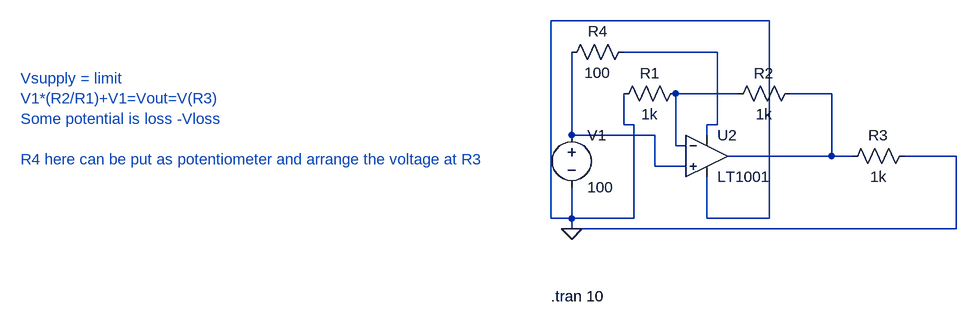
[diagram p0: schematic single supply opamp for voltage regulation.asc]
single supply opamp for voltage regulation.asc, the LTspice schematic file:
Version 4
SHEET 1 880 680
WIRE 320 -48 -16 -48
WIRE 240 0 96 0
WIRE 272 64 176 64
WIRE 416 64 352 64
WIRE 96 112 96 64
WIRE 112 112 96 112
WIRE 240 112 240 0
WIRE 240 112 224 112
WIRE 16 128 16 0
WIRE 144 128 16 128
WIRE 224 128 224 112
WIRE 176 144 176 64
WIRE 192 144 176 144
WIRE 416 160 416 64
WIRE 416 160 256 160
WIRE 448 160 416 160
WIRE 608 160 528 160
WIRE 144 176 144 128
WIRE 192 176 144 176
WIRE -16 256 -16 -48
WIRE 16 256 16 208
WIRE 16 256 -16 256
WIRE 112 256 112 112
WIRE 112 256 16 256
WIRE 224 256 224 192
WIRE 320 256 320 -48
WIRE 320 256 224 256
WIRE 16 272 16 256
WIRE 608 272 608 160
WIRE 608 272 16 272
FLAG 16 272 0
SYMBOL voltage 16 112 R0
WINDOW 123 0 0 Left 0
WINDOW 39 0 0 Left 0
SYMATTR InstName V1
SYMATTR Value 100
SYMBOL res 192 48 R90
WINDOW 0 0 56 VBottom 2
WINDOW 3 32 56 VTop 2
SYMATTR InstName R1
SYMATTR Value 1k
SYMBOL res 368 48 R90
WINDOW 0 0 56 VBottom 2
WINDOW 3 32 56 VTop 2
SYMATTR InstName R2
SYMATTR Value 1k
SYMBOL OpAmps\\LT1001 224 96 R0
SYMATTR InstName U2
SYMBOL res 544 144 R90
WINDOW 0 0 56 VBottom 2
WINDOW 3 32 56 VTop 2
SYMATTR InstName R3
SYMATTR Value 1k
SYMBOL res 112 -16 R90
WINDOW 0 0 56 VBottom 2
WINDOW 3 32 56 VTop 2
SYMATTR InstName R4
SYMATTR Value 100
TEXT -16 376 Left 2 !.tran 10
TEXT -832 40 Left 2 ;Vsupply = limit\nV1*(R2/R1)+V1=Vout=V(R3)\nSome potential is loss -Vloss\n \nR4 here can be put as potentiometer and arrange the voltage at R3

The netlist it stands for:
* single supply opamp for voltage regulation.asc
V1 N004 0 100
R1 N002 0 1k
R2 N003 N002 1k
XU2 N004 N002 N001 0 N003 LT1001  ; pins In+ In- V+ V- OUT
R3 0 N003 1k
R4 N001 N004 100
.tran 10
* Vsupply = limit
* V1*(R2/R1)+V1=Vout=V(R3)
* Some potential is loss -Vloss
* R4 here can be put as potentiometer and arrange the voltage at R3
.lib LTC.lib
.backanno
.end